# Altium schematic sheet I2C-Buffer - LTC4303 .SchDoc
size A4
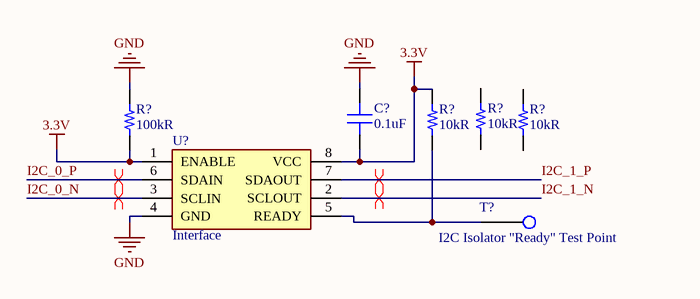
[diagram p0: I2C-Buffer - LTC4303 .SchDoc]

## Parts
(Parts that share a designator on the sheet are numbered #1, #2 ... from top to bottom, then left to right.)
C?  0.1uF  [CAP 0603_1608]
R?#1  100kR  [RES 0603_1608]
R?#2  10kR  [RES 0603_1608]
R?#3  10kR  [RES 0603_1608]
R?#4  10kR  [RES 0603_1608]
T?  I2C Isolator "Ready" Test Point  [TP]
U?  Interface  [Interface]

## Nets
3.3V: C?.1 R?#1.1 R?#2.2 U?.1(ENABLE) U?.8(VCC)
GND: C?.2 R?#1.2 U?.4(GND)
I2C_0_N: U?.3(SCLIN)
I2C_0_P: U?.6(SDAIN)
I2C_1_N: U?.2(SCLOUT)
I2C_1_P: U?.7(SDAOUT)
NetR?#2_1: R?#2.1 T?.1 U?.5(READY)

Not connected (* = marked no-connect by the designer): R?#3 1 2; R?#4 1 2

## Layout directives
differential pair: I2C_0_N, I2C_0_P, I2C_1_N, I2C_1_P

## Library data of the parts
C? = C0603C104K5RACTU: KEMET - C0603C104K5RACTU - SMD Multilayer Cer; Dielectric Material: Ceramic; Capacitance: 100nF; Tolerance: 10%; Voltage Rating (DC): 50V; Dielectric: X7R; Part Number: C0603C104K5RACTU; Value: 0.1uF; Part Name: C0603C104K5RACTU; Supplier 1: Mouser; Supplier Part Number 1: 80-C0603C104K5R; Manufacturer: KEMET; Manufacturer Part Number: C0603C104K5RACTU; RoHS: Yes; Category: Ceramic Capacitors; Stock 1: 3092110; Pricing 1: 1=0.26000, 10=0.11800, 50=0.11800, 100=0.0730; Mount: Surface Mount; Case/Package: 0603; Case Code (Metric): 1608; Case Code (Imperial): 0603; Min Operating Temperature: -55°C; Max Operating Temperature: 125°C; Packaging: Tape and Reel; Package Quantity: 4000; Termination: SMD/SMT; Voltage: 50V; Length: 1.6mm; Width: 0.8mm; RoHS Compliant: Yes; ComponentLink1URL: https://datasheet.ciiva.com/29242/457901-da-0; ComponentLink1Description: https://datasheet.ciiva.com/29242/457901-da-0; Supplier 2: Mouser; Supplier Part Number 2: 80-C0603C104K5RAC; Stock 2: 377106; Pricing 2: 1=0.26000, 10=0.11800, 50=0.11800, 100=0.0730; Material: Ceramic
R?#1 = TNPW0603100KBEEA: VISHAY - TNPW0603100KBEEA - RES, THIN FILM, 1; Manufacturer: Vishay Dale; Tolerance: 0.1%; Temperature Coefficient: 25ppm/°C; Power Rating: 100mW; Voltage Rating: 75V; Part Number: TNPW0603100KBEEA; Value: 100kR; Case/Package: 0603; Contact Plating: Tin; Part Name: TNPW0603100KBEEA; Supplier 1: Digi-Key; Supplier Part Number 1: TNP100KAACT-ND; Manufacturer Part Number: TNPW0603100KBEEA; RoHS: Yes; Category: Chip SMD Resistors; Stock 1: 39250; Pricing 1: 1=0.56000, 10=0.40000, 100=0.20800, 1000=0.11; Mount: Surface Mount; Min Operating Temperature: -55°C; Max Operating Temperature: 125°C; Resistance: 100kR; Resistor Type: Thin Film; Packaging: Tape and Reel; Construction: Rectangular; Technology: THIN FILM; Series: TNPW; Length: 1.6mm; Height: 0.45mm; Depth: 0.85mm; Radiation Hardening: No; Military Standard: Not; RoHS Compliant: Yes; ComponentLink1URL: https://datasheet.ciiva.com/16201/tnpw-e3-162; ComponentLink1Description: https://datasheet.ciiva.com/16201/tnpw-e3-162; ComponentLink2URL: https://datasheet.ciiva.com/8979/tnpw-e3-8979; ComponentLink2Description: https://datasheet.ciiva.com/8979/tnpw-e3-8979; ComponentLink3URL: https://datasheet.ciiva.com/7792/tnpw-e3-7792; ComponentLink3Description: https://datasheet.ciiva.com/7792/tnpw-e3-7792; Case Code (Imperial): 0603; Case Code (Metric): 1608; Weight: 7.1E-05oz; Termination: SMD/SMT; Package Quantity: 1; Number of Terminations: 2; Max Power Dissipation: 100mW; Voltage Rating (DC): 75V; Working Voltage: 75V; Features: Moisture Resistant,Automotive AEC-Q200,Anti-S; Resistance Tolerance: 0.1%; Width: 0.8mm; REACH SVHC: Unknown; Lead Free: Lead Free; ComponentLink4URL: https://datasheet.ciiva.com/15159/getdatashee; ComponentLink4Description: https://datasheet.ciiva.com/15159/getdatashee; ComponentLink5URL: https://datasheet.ciiva.com/22869/70201627-22; ComponentLink5Description: https://datasheet.ciiva.com/22869/70201627-22; ComponentLink6URL: https://datasheet.ciiva.com/2483/tnpw-e3-2483; ComponentLink6Description: https://datasheet.ciiva.com/2483/tnpw-e3-2483; ComponentLink7URL: https://datasheet.ciiva.com/46422/1794177-464; ComponentLink7Description: https://datasheet.ciiva.com/46422/1794177-464; ComponentLink8URL: https://datasheet.ciiva.com/2483/tnpw-e3-2483; ComponentLink8Description: https://datasheet.ciiva.com/2483/tnpw-e3-2483; ComponentLink9URL: https://datasheet.ciiva.com/16767/70201627-16; ComponentLink9Description: https://datasheet.ciiva.com/16767/70201627-16; ComponentLink10URL: https://datasheet.ciiva.com/2483/tnpw-e3-2483; ComponentLink10Description: https://datasheet.ciiva.com/2483/tnpw-e3-2483; ComponentLink11URL: https://datasheet.ciiva.com/46436/tnpw-e3-464; ComponentLink11Description: https://datasheet.ciiva.com/46436/tnpw-e3-464
R?#2-R?#4 = TNPW060310K0BYEN: Res Thin Film 0603 10K Ohm 0.1% 1/10W 10ppm/C; Manufacturer: Vishay; Temperature Coefficient: 10ppm/°C; Power Rating: 100mW; Part Number: TNPW060310K0BYEN; Value: 10kR; Case/Package: 0603; Contact Plating: Tin; Part Name: TNPW060310K0BYEN; Supplier 1: Mouser; Supplier Part Number 1: 71-TNPW060310K0BYEN; Manufacturer Part Number: TNPW060310K0BYEN; RoHS: Yes; Category: Chip SMD Resistors; Stock 1: 3725; Pricing 1: 1=0.76000, 10=0.66000, 50=0.66000, 100=0.4600; Mount: Surface Mount; Min Operating Temperature: -55°C; Max Operating Temperature: 125°C; Resistance: 10kR; Tolerance: 0.1%; Resistor Type: Thin Film; Packaging: Tape and Reel; Construction: Rectangular; Technology: THIN FILM; Series: TNPW; Length: 1.6mm; Height: 0.45mm; Depth: 0.85mm; Radiation Hardening: No; Military Standard: Not; RoHS Compliant: Yes; ComponentLink1URL: https://datasheet.ciiva.com/11811/0900766b80d; ComponentLink1Description: https://datasheet.ciiva.com/11811/0900766b80d; ComponentLink2URL: https://datasheet.ciiva.com/9052/tnpw-e3-9052; ComponentLink2Description: https://datasheet.ciiva.com/9052/tnpw-e3-9052; ComponentLink3URL: https://datasheet.ciiva.com/17190/tnpw-e3-171; ComponentLink3Description: https://datasheet.ciiva.com/17190/tnpw-e3-171; Case Code (Imperial): 0603; Case Code (Metric): 1608
T? = Test Point 2mm: Pitch: 2.54mm; Max Current Rating: 6.9A; Contact Resistance: 10mR; Max Voltage Rating (AC): 550V; Part Number: Test Point 2mm; Part Name: Test Point 2mm; Orientation: Straight; ComponentLink1URL: http://components.arrow.com/part/dataview/032; ComponentLink1Description: http://components.arrow.com/part/dataview/032; ComponentLink2URL: http://www.farnell.com/datasheets/1902536.pdf; ComponentLink2Description: http://www.farnell.com/datasheets/1902536.pdf; ComponentLink3URL: http://cloud.samtec.com/catalog_english/ESW_T; ComponentLink3Description: http://cloud.samtec.com/catalog_english/ESW_T; ComponentLink4URL: http://suddendocs.samtec.com/prints/esq-1xx-x; ComponentLink4Description: http://suddendocs.samtec.com/prints/esq-1xx-x; ComponentLink5URL: http://www.samtec.com/documents/webfiles/pdf/; ComponentLink5Description: http://www.samtec.com/documents/webfiles/pdf/; ComponentLink6URL: http://www.farnell.com/datasheets/1902536.pdf; ComponentLink6Description: http://www.farnell.com/datasheets/1902536.pdf; Length: 66.55mm; Lead Pitch: 2.54mm; Depth: 4.95mm; Radiation Hardening: No; REACH SVHC: No SVHC
U? = LTC4303IMS8#PBF: I²C Logic Buffer 3.3V/5V 8-Pin MSOP; Manufacturer: Analog Devices / Linear Technology; Max Supply Voltage: 5.5V; Min Supply Voltage: 2.7V; Part Number: LTC4303IMS8#PBF; Value: 8-pin; Part Name: LTC4303IMS8#PBF; Supplier 1: Mouser; Supplier Part Number 1: 584-LTC4303IMS8#PBF; Manufacturer Part Number: LTC4303IMS8#PBF; RoHS: Yes; Category: Interface ICs; Stock 1: 6055; Pricing 1: 1=6.71000, 10=5.70000, 50=5.55000, 100=4.9400; Mount: Surface Mount; Case/Package: MSOP; Number of Pins: 8; Min Operating Temperature: -40°C; Max Operating Temperature: 85°C; Packaging: Rail/Tube; Package Quantity: 50